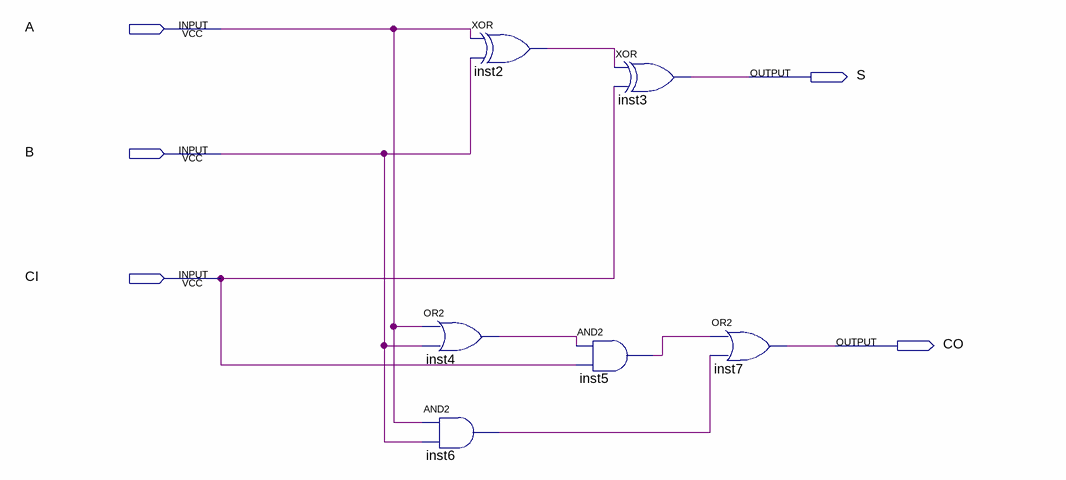
[diagram p0: schematic sheet]
// Quartus schematic aBc.bdf as structural Verilog: 6 symbols, 5 pins
module aBc (
  input  A,
  input  B,
  input  CI,
  output S,
  output CO
);

  wire inst2_out, inst4_out, inst5_out, inst6_out;

  or inst4 (inst4_out, A, B);
  and inst6 (inst6_out, A, B);
  xor inst2 (inst2_out, A, B);
  xor inst3 (S, inst2_out, CI);
  and inst5 (inst5_out, inst4_out, CI);
  or inst7 (CO, inst5_out, inst6_out);
endmodule
